# EAGLE design RatDBS-BatteryBoard (EAGLE 7.7.0)
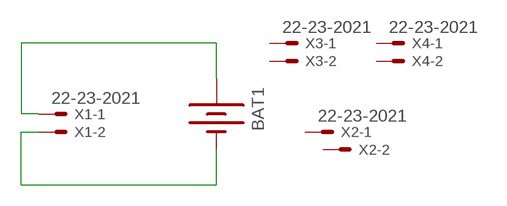
[diagram p0: schematic, sheet 1]

## Parts
BAT1  BATTERY  [BATTCOM_20MM_PLASTIC_STUDS]
X1  22-23-2021  [22-23-2021]
X2  22-23-2021  [22-23-2021]
X3  22-23-2021  [22-23-2021]
X4  22-23-2021  [22-23-2021]

## Nets
BATIN: BAT1.1(+) X1.1
GND: BAT1.2(-) X1.2
Unconnected: X2.1 X2.2 X3.1 X3.2 X4.1 X4.2

## Library data of the parts
BAT1 = Battery:BATTERY: Compact CR2032 Battery Holder SMT ground pad 20MM_4LEGS, Digikey: BAT-HLD-001-THM-OTL
X1-X4 = con-molex:22-23-2021: .100" (2.54mm) Center Header - 2 Pin; MF: MOLEX; MPN: 22-23-2021; OC_FARNELL: 1462926; OC_NEWARK: 25C3832

## Board
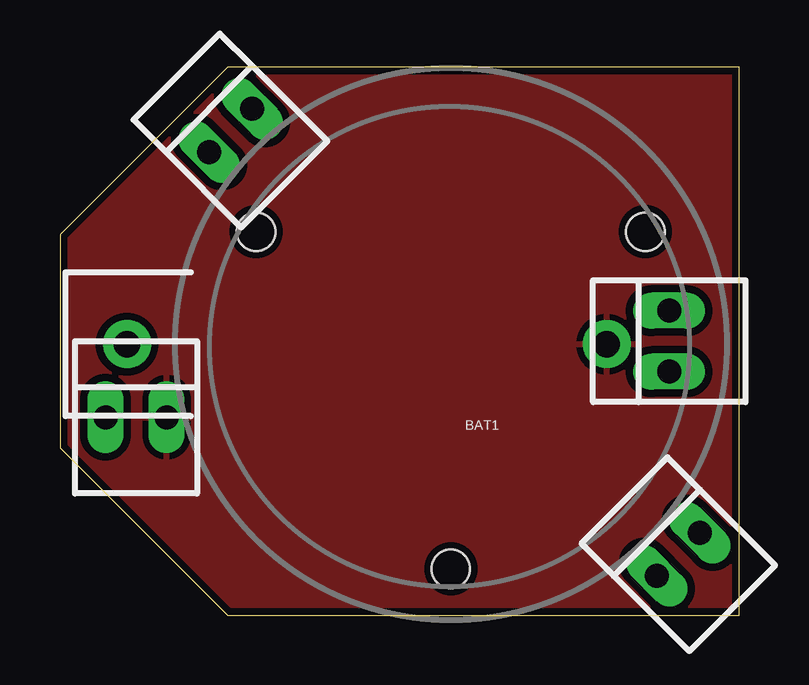
[diagram p1: board, top side]
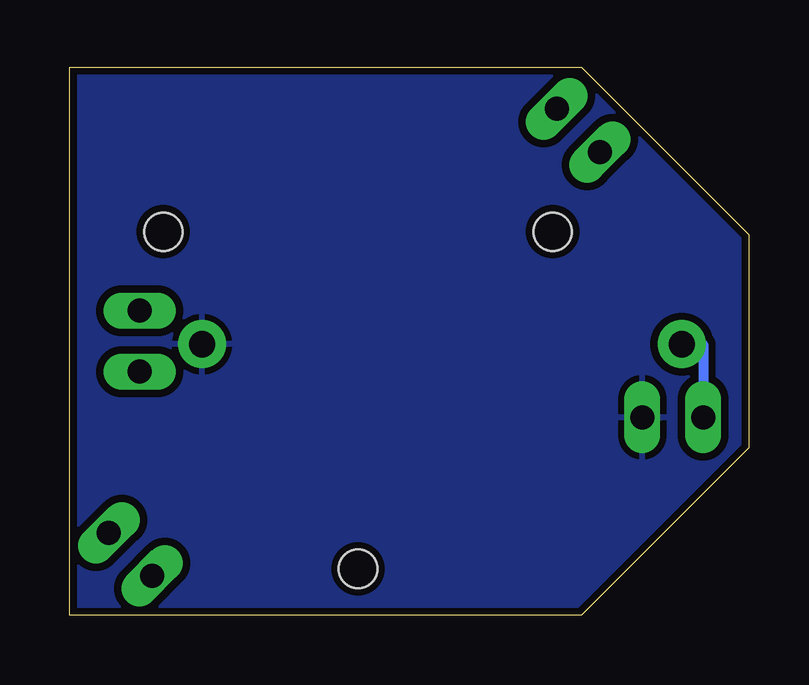
[diagram p2: board, bottom side, seen from below]

Size 28.32 x 22.86 mm. Coordinates in mm from the lower left corner, seen from the top.
Outline: 28.32,22.86 6.99,22.86 0,15.88 0,6.99 6.99,0 28.32,0 28.32,22.86
Copper layers (1*16): Top 0.035mm / dielectric 1.5mm / Bottom 0.035mm
Design rules "Seeed_DRU": minimum track width 6mil, minimum drill 12mil, track to track 6mil, track to pad 6mil, pad to pad 6mil, via to via 6mil, smd to smd 0mil, copper to edge 10mil, drill to drill 10mil, minimum pad ring 10mil, minimum via ring 6mil, stop-mask expansion 2mil, vias tented up to drill 100mil, thermal gap 10mil

### Footprints (pad centres in the part's own frame; a part is rotated, then mirrored left to right if it is on the bottom)
BATTCOM_20MM_PLASTIC_STUDS = drill 1.1 pad 2: 1 13.5,0; 2 -6.5,0 | hole 1.6: 0,9.37; -8.115,-4.685; 8.115,-4.685
22-23-2021 = drill 1 long: 1 -1.27,0; 2 1.27,0

### Placement (x,y rotation side)
BAT1  16.29,11.3 180 top
X1  3.17,8.26 0 top
X2  25.4,11.43 90 top
X3  25.78,2.54 45 top
X4  7.11,20.21 45 top

### Tracks (layer width: path | path; a pad name or v marks a point on that pad's centre or on a via)
BATIN
  Bottom 0.406: BAT1.1 1.91,11.3 X1.1
GND
  pour Top (isolate 0.305): 0,0 0,22.86 28.32,22.86 28.32,0
  pour Bottom (isolate 0.305): 0,0 0,22.86 28.32,22.86 28.32,0

### Text on the board
tDocu: + - | 5V
bDocu: NFC-RDBS / Kemere Lab / v3.0 Just Bat / (C) 2017